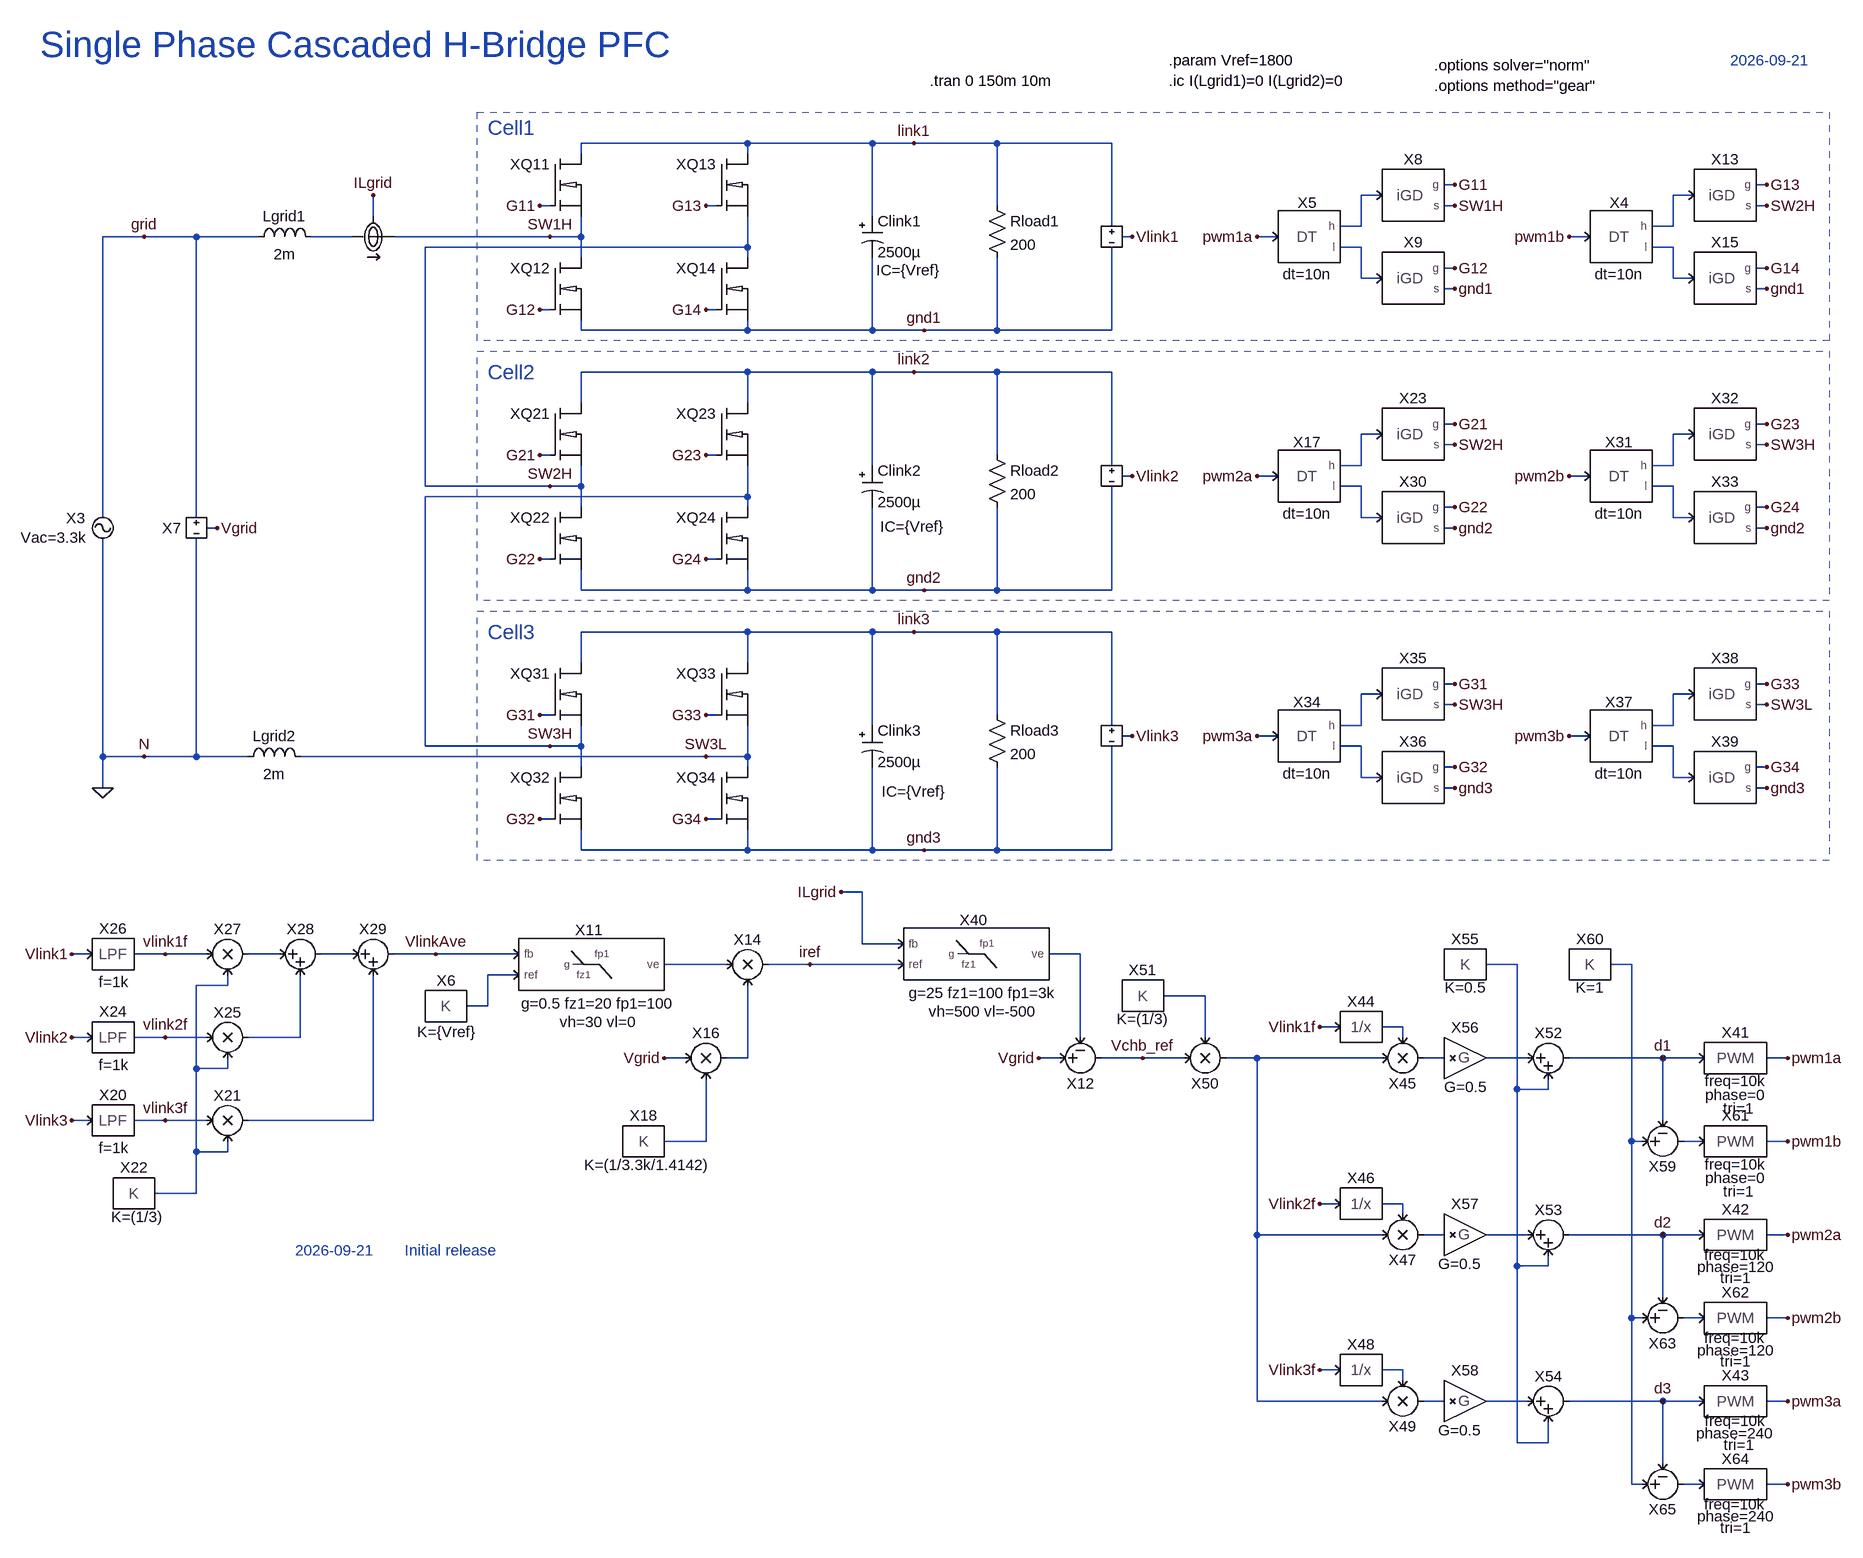
[diagram p0: schematic 1Ph-CHB-PFC_3Cell.asc]
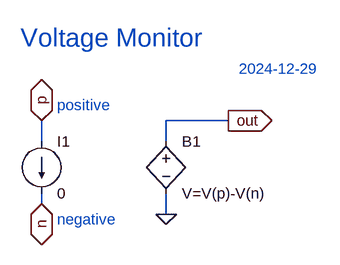
[diagram p1: sub-circuit vmon.asc]
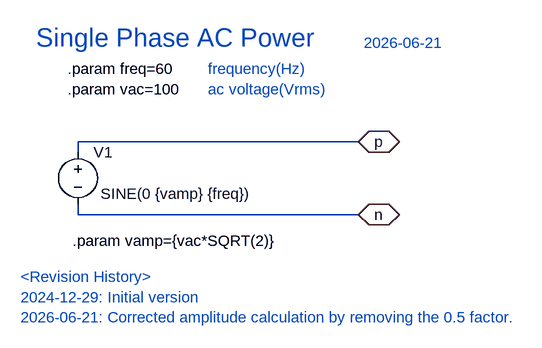
[diagram p2: sub-circuit vac1ph.asc]
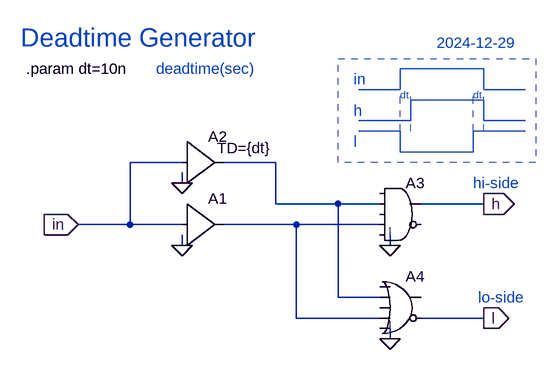
[diagram p3: sub-circuit deadtime.asc]
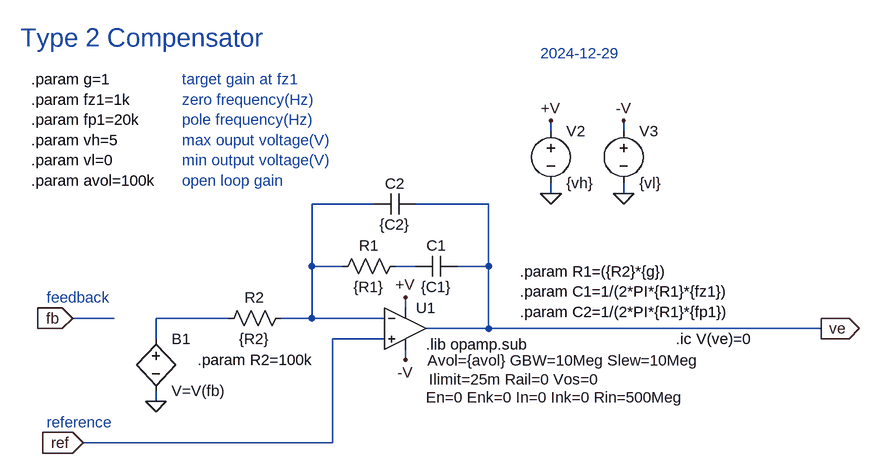
[diagram p4: sub-circuit type2.asc]
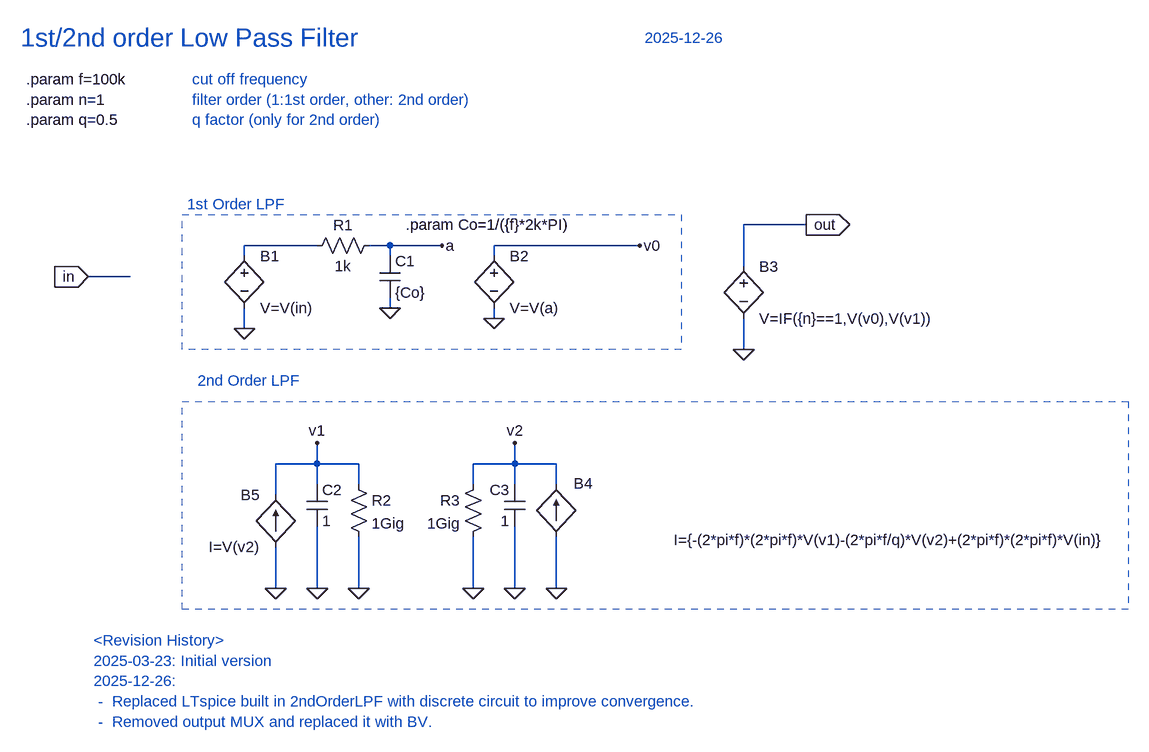
[diagram p5: sub-circuit lpf.asc]
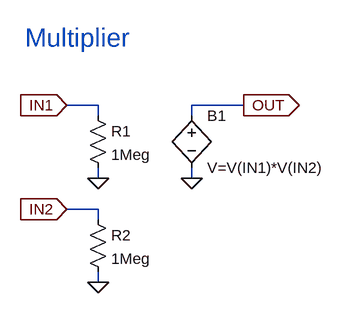
[diagram p6: sub-circuit mul.asc]
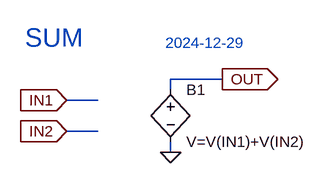
[diagram p7: sub-circuit sum.asc]
1Ph-CHB-PFC_3Cell.asc, the LTspice schematic file:
Version 4.1
SHEET 1 4184 2256
WIRE 272 -224 16 -224
WIRE 464 -224 272 -224
WIRE 528 -224 464 -224
WIRE 656 -224 528 -224
WIRE 832 -224 656 -224
WIRE 16 -208 16 -224
WIRE 272 -208 272 -224
WIRE 1360 -160 1344 -160
WIRE 1840 -160 1824 -160
WIRE 1248 -144 1216 -144
WIRE 1728 -144 1696 -144
WIRE -32 -128 -48 -128
WIRE 224 -128 208 -128
WIRE 656 -128 656 -224
WIRE 1360 -128 1344 -128
WIRE 1840 -128 1824 -128
WIRE -304 -112 -304 -144
WIRE 464 -112 464 -224
WIRE 832 -96 832 -224
WIRE 1216 -96 1216 -144
WIRE 1216 -96 1184 -96
WIRE 1696 -96 1696 -144
WIRE 1696 -96 1664 -96
WIRE -656 -80 -720 -80
WIRE -576 -80 -656 -80
WIRE -480 -80 -576 -80
WIRE -336 -80 -400 -80
WIRE -32 -80 -272 -80
WIRE 16 -80 16 -112
WIRE 16 -80 -32 -80
WIRE 864 -80 848 -80
WIRE 1088 -80 1056 -80
WIRE 1568 -80 1536 -80
WIRE 272 -64 272 -112
WIRE 272 -64 -224 -64
WIRE 1216 -64 1184 -64
WIRE 1696 -64 1664 -64
WIRE 16 -48 16 -80
WIRE 272 -48 272 -64
WIRE 1360 -32 1344 -32
WIRE 1840 -32 1824 -32
WIRE 1216 -16 1216 -64
WIRE 1248 -16 1216 -16
WIRE 1696 -16 1696 -64
WIRE 1728 -16 1696 -16
WIRE 1360 0 1344 0
WIRE 1840 0 1824 0
WIRE -32 32 -48 32
WIRE 224 32 208 32
WIRE 16 64 16 48
WIRE 272 64 272 48
WIRE 272 64 16 64
WIRE 464 64 464 -48
WIRE 464 64 272 64
WIRE 544 64 464 64
WIRE 656 64 656 -48
WIRE 656 64 544 64
WIRE 832 64 832 -64
WIRE 832 64 656 64
WIRE 272 128 16 128
WIRE 464 128 272 128
WIRE 528 128 464 128
WIRE 656 128 528 128
WIRE 832 128 656 128
WIRE 16 176 16 128
WIRE 272 176 272 128
WIRE 1360 208 1344 208
WIRE 1840 208 1824 208
WIRE 1248 224 1216 224
WIRE 1728 224 1696 224
WIRE 1360 240 1344 240
WIRE 1840 240 1824 240
WIRE -32 256 -48 256
WIRE 224 256 208 256
WIRE 656 256 656 128
WIRE 464 272 464 128
WIRE 832 272 832 128
WIRE 1216 272 1216 224
WIRE 1216 272 1184 272
WIRE 1696 272 1696 224
WIRE 1696 272 1664 272
WIRE 864 288 848 288
WIRE 1088 288 1056 288
WIRE 1568 288 1536 288
WIRE -224 304 -224 -64
WIRE -32 304 -224 304
WIRE 16 304 16 272
WIRE 16 304 -32 304
WIRE 1216 304 1184 304
WIRE 1696 304 1664 304
WIRE 272 320 272 272
WIRE 272 320 -224 320
WIRE 16 336 16 304
WIRE 272 336 272 320
WIRE 1360 336 1344 336
WIRE 1840 336 1824 336
WIRE -720 352 -720 -80
WIRE -576 352 -576 -80
WIRE 1216 352 1216 304
WIRE 1248 352 1216 352
WIRE 1696 352 1696 304
WIRE 1728 352 1696 352
WIRE -544 368 -560 368
WIRE 1360 368 1344 368
WIRE 1840 368 1824 368
WIRE -32 416 -48 416
WIRE 224 416 208 416
WIRE 16 464 16 432
WIRE 272 464 272 432
WIRE 272 464 16 464
WIRE 464 464 464 336
WIRE 464 464 272 464
WIRE 544 464 464 464
WIRE 656 464 656 336
WIRE 656 464 544 464
WIRE 832 464 832 304
WIRE 832 464 656 464
WIRE 272 528 16 528
WIRE 464 528 272 528
WIRE 528 528 464 528
WIRE 656 528 528 528
WIRE 832 528 656 528
WIRE 16 576 16 528
WIRE 272 576 272 528
WIRE 1360 608 1344 608
WIRE 1840 608 1824 608
WIRE 1248 624 1216 624
WIRE 1728 624 1696 624
WIRE 1360 640 1344 640
WIRE 1840 640 1824 640
WIRE -32 656 -48 656
WIRE 224 656 208 656
WIRE 656 656 656 528
WIRE 464 672 464 528
WIRE 832 672 832 528
WIRE 1216 672 1216 624
WIRE 1216 672 1184 672
WIRE 1696 672 1696 624
WIRE 1696 672 1664 672
WIRE 864 688 848 688
WIRE 1088 688 1056 688
WIRE 1568 688 1536 688
WIRE -224 704 -224 320
WIRE -32 704 -224 704
WIRE 16 704 16 672
WIRE 16 704 -32 704
WIRE 1216 704 1184 704
WIRE 1696 704 1664 704
WIRE -720 720 -720 384
WIRE -656 720 -720 720
WIRE -576 720 -576 384
WIRE -576 720 -656 720
WIRE -496 720 -576 720
WIRE 208 720 -416 720
WIRE 272 720 272 672
WIRE 272 720 208 720
WIRE 16 736 16 704
WIRE 272 736 272 720
WIRE 1360 736 1344 736
WIRE 1840 736 1824 736
WIRE 1216 752 1216 704
WIRE 1248 752 1216 752
WIRE 1696 752 1696 704
WIRE 1728 752 1696 752
WIRE -720 768 -720 720
WIRE 1360 768 1344 768
WIRE 1840 768 1824 768
WIRE -32 816 -48 816
WIRE 224 816 208 816
WIRE 16 864 16 832
WIRE 272 864 272 832
WIRE 272 864 16 864
WIRE 464 864 464 736
WIRE 464 864 272 864
WIRE 544 864 464 864
WIRE 656 864 656 736
WIRE 656 864 544 864
WIRE 832 864 832 704
WIRE 832 864 656 864
WIRE 448 928 416 928
WIRE 448 1008 448 928
WIRE 512 1008 448 1008
WIRE -736 1024 -768 1024
WIRE -624 1024 -672 1024
WIRE -560 1024 -624 1024
WIRE -448 1024 -496 1024
WIRE -336 1024 -384 1024
WIRE -208 1024 -272 1024
WIRE -80 1024 -208 1024
WIRE 784 1024 736 1024
WIRE 240 1040 144 1040
WIRE 368 1040 304 1040
WIRE 512 1040 368 1040
WIRE 1456 1040 1408 1040
WIRE 1632 1040 1600 1040
WIRE -80 1056 -128 1056
WIRE -528 1072 -528 1056
WIRE -528 1072 -576 1072
WIRE 976 1088 912 1088
WIRE -128 1104 -128 1056
WIRE -128 1104 -160 1104
WIRE 1184 1136 1152 1136
WIRE 1280 1136 1248 1136
WIRE -736 1152 -768 1152
WIRE -624 1152 -672 1152
WIRE -560 1152 -624 1152
WIRE -416 1152 -416 1056
WIRE -416 1152 -496 1152
WIRE 784 1152 784 1024
WIRE 976 1152 976 1088
WIRE 1280 1152 1280 1136
WIRE 176 1184 144 1184
WIRE 272 1184 272 1072
WIRE 272 1184 240 1184
WIRE 752 1184 720 1184
WIRE 880 1184 816 1184
WIRE 944 1184 880 1184
WIRE 1056 1184 1008 1184
WIRE 1248 1184 1056 1184
WIRE 1344 1184 1312 1184
WIRE 1472 1184 1408 1184
WIRE 1680 1184 1536 1184
WIRE 1744 1184 1680 1184
WIRE 1872 1184 1840 1184
WIRE -576 1200 -576 1072
WIRE -528 1200 -528 1184
WIRE -528 1200 -576 1200
WIRE 1456 1232 1456 1040
WIRE 1504 1232 1504 1216
WIRE 1504 1232 1456 1232
WIRE -736 1280 -768 1280
WIRE -624 1280 -672 1280
WIRE -560 1280 -624 1280
WIRE -304 1280 -304 1056
WIRE -304 1280 -496 1280
WIRE 1680 1280 1680 1184
WIRE 208 1312 208 1216
WIRE 208 1312 144 1312
WIRE 1632 1312 1632 1040
WIRE 1648 1312 1632 1312
WIRE 1744 1312 1712 1312
WIRE 1872 1312 1840 1312
WIRE -576 1328 -576 1200
WIRE -528 1328 -528 1312
WIRE -528 1328 -576 1328
WIRE -576 1392 -576 1328
WIRE -576 1392 -640 1392
WIRE 1184 1408 1152 1408
WIRE 1280 1408 1248 1408
WIRE 1280 1424 1280 1408
WIRE 1056 1456 1056 1184
WIRE 1248 1456 1056 1456
WIRE 1344 1456 1312 1456
WIRE 1472 1456 1408 1456
WIRE 1680 1456 1536 1456
WIRE 1744 1456 1680 1456
WIRE 1872 1456 1840 1456
WIRE 1456 1504 1456 1232
WIRE 1504 1504 1504 1488
WIRE 1504 1504 1456 1504
WIRE 1680 1552 1680 1456
WIRE 1632 1584 1632 1312
WIRE 1648 1584 1632 1584
WIRE 1744 1584 1712 1584
WIRE 1872 1584 1840 1584
WIRE 1184 1664 1152 1664
WIRE 1280 1664 1248 1664
WIRE 1280 1680 1280 1664
WIRE 1056 1712 1056 1456
WIRE 1248 1712 1056 1712
WIRE 1344 1712 1312 1712
WIRE 1472 1712 1408 1712
WIRE 1680 1712 1536 1712
WIRE 1744 1712 1680 1712
WIRE 1872 1712 1840 1712
WIRE 1456 1776 1456 1504
WIRE 1504 1776 1504 1744
WIRE 1504 1776 1456 1776
WIRE 1680 1808 1680 1712
WIRE 1632 1840 1632 1584
WIRE 1648 1840 1632 1840
WIRE 1744 1840 1712 1840
WIRE 1872 1840 1840 1840
FLAG -48 -128 G11
FLAG -48 32 G12
FLAG -32 -80 SW1H
FLAG 528 -224 link1
FLAG -656 -80 grid
FLAG -304 -144 ILgrid
FLAG 864 -80 Vlink1
FLAG -544 368 Vgrid
FLAG 1360 -160 G11
FLAG 1360 -128 SW1H
FLAG 1360 -32 G12
FLAG 1360 0 gnd1
FLAG 208 -128 G13
FLAG 208 32 G14
FLAG -48 256 G21
FLAG -48 416 G22
FLAG 528 128 link2
FLAG 864 288 Vlink2
FLAG 208 256 G23
FLAG 208 416 G24
FLAG -48 656 G31
FLAG -48 816 G32
FLAG 528 528 link3
FLAG 864 688 Vlink3
FLAG 208 656 G33
FLAG 208 816 G34
FLAG -768 1280 Vlink3
FLAG -768 1152 Vlink2
FLAG -768 1024 Vlink1
FLAG -208 1024 VlinkAve
FLAG 544 64 gnd1
FLAG 544 464 gnd2
FLAG 544 864 gnd3
FLAG 1840 -160 G13
FLAG 1840 -128 SW2H
FLAG 1840 -32 G14
FLAG 1840 0 gnd1
FLAG 1360 208 G21
FLAG 1360 240 SW2H
FLAG 1360 336 G22
FLAG 1360 368 gnd2
FLAG 1840 208 G23
FLAG 1840 240 SW3H
FLAG 1840 336 G24
FLAG 1840 368 gnd2
FLAG -32 304 SW2H
FLAG -32 704 SW3H
FLAG -656 720 N
FLAG 1360 608 G31
FLAG 1360 640 SW3H
FLAG 1360 736 G32
FLAG 1360 768 gnd3
FLAG 1840 608 G33
FLAG 1840 640 SW3L
FLAG 1840 736 G34
FLAG 1840 768 gnd3
FLAG 208 720 SW3L
FLAG 416 928 ILgrid
FLAG 144 1184 Vgrid
FLAG 368 1040 iref
FLAG 720 1184 Vgrid
FLAG 880 1184 Vchb_ref
FLAG 1056 -80 pwm1a
FLAG 1536 -80 pwm1b
FLAG 1056 288 pwm2a
FLAG 1536 288 pwm2b
FLAG 1056 688 pwm3a
FLAG 1536 688 pwm3b
FLAG 1872 1184 pwm1a
FLAG 1872 1312 pwm1b
FLAG 1872 1456 pwm2a
FLAG 1872 1584 pwm2b
FLAG 1872 1712 pwm3a
FLAG 1872 1840 pwm3b
FLAG 1152 1136 Vlink1f
FLAG 1152 1408 Vlink2f
FLAG 1152 1664 Vlink3f
FLAG 1680 1184 d1
FLAG 1680 1456 d2
FLAG 1680 1712 d3
FLAG -720 768 0
FLAG -624 1024 vlink1f
FLAG -624 1152 vlink2f
FLAG -624 1280 vlink3f
SYMBOL ind -496 -64 R270
WINDOW 0 32 56 VTop 2
WINDOW 3 5 56 VBottom 2
SYMATTR InstName Lgrid1
SYMATTR Value 2m
SYMATTR SpiceLine Rser=1m
SYMBOL polcap 448 -112 R0
WINDOW 3 24 56 Left 2
WINDOW 123 22 83 Left 2
SYMATTR Value 2500µ
SYMATTR Value2 IC={Vref}
SYMATTR InstName Clink1
SYMATTR Description Capacitor
SYMATTR Type cap
SYMATTR SpiceLine Rser=10m
SYMBOL res 640 -144 R0
SYMATTR InstName Rload1
SYMATTR Value 200
SYMBOL IMON -304 -80 M180
WINDOW 0 0 -26 Invisible 2
SYMATTR InstName X1
SYMBOL VMON 832 -80 R0
WINDOW 0 57 -5 Invisible 2
SYMATTR InstName X2
SYMBOL VAC1ph -720 368 R0
WINDOW 39 -25 15 Right 2
WINDOW 0 -27 -15 Right 2
SYMATTR SpiceLine Vac=3.3k
SYMATTR InstName X3
SYMBOL DEADTIME 1136 -80 R0
WINDOW 0 -3 -68 Top 2
WINDOW 39 -3 42 Top 2
SYMATTR InstName X5
SYMBOL CONST -192 1104 R0
WINDOW 39 1 55 Bottom 2
SYMATTR SpiceLine K={Vref}
SYMATTR InstName X6
SYMBOL VMON -576 368 R0
WINDOW 0 -23 0 Right 2
SYMATTR InstName X7
SYMBOL iGD 1296 -144 R0
SYMATTR InstName X8
SYMBOL iGD 1296 -16 R0
SYMATTR InstName X9
SYMBOL TYPE2 32 1040 R0
WINDOW 0 -4 -53 Center 2
WINDOW 39 10 60 Center 2
WINDOW 40 10 88 Center 2
SYMATTR InstName X11
SYMATTR SpiceLine g=0.5 fz1=20 fp1=100
SYMATTR SpiceLine2 vh=30 vl=0
SYMBOL iNMOS 16 -160 R0
SYMATTR InstName XQ11
SYMBOL iNMOS 16 0 R0
SYMATTR InstName XQ12
SYMBOL iNMOS 272 -160 R0
SYMATTR InstName XQ13
SYMBOL iNMOS 272 0 R0
SYMATTR InstName XQ14
SYMBOL polcap 448 272 R0
WINDOW 3 24 56 Left 2
WINDOW 123 28 94 Left 2
SYMATTR Value 2500µ
SYMATTR Value2 IC={Vref}
SYMATTR InstName Clink2
SYMATTR Description Capacitor
SYMATTR Type cap
SYMATTR SpiceLine Rser=10m
SYMBOL res 640 240 R0
SYMATTR InstName Rload2
SYMATTR Value 200
SYMBOL VMON 832 288 R0
WINDOW 0 57 -5 Invisible 2
SYMATTR InstName X10
SYMBOL iNMOS 16 224 R0
SYMATTR InstName XQ21
SYMBOL iNMOS 16 384 R0
SYMATTR InstName XQ22
SYMBOL iNMOS 272 224 R0
SYMATTR InstName XQ23
SYMBOL iNMOS 272 384 R0
SYMATTR InstName XQ24
SYMBOL polcap 448 672 R0
WINDOW 3 24 56 Left 2
WINDOW 123 30 102 Left 2
SYMATTR Value 2500µ
SYMATTR Value2 IC={Vref}
SYMATTR InstName Clink3
SYMATTR Description Capacitor
SYMATTR Type cap
SYMATTR SpiceLine Rser=10m
SYMBOL res 640 640 R0
SYMATTR InstName Rload3
SYMATTR Value 200
SYMBOL VMON 832 688 R0
WINDOW 0 57 -5 Invisible 2
SYMATTR InstName X19
SYMBOL iNMOS 16 624 R0
SYMATTR InstName XQ31
SYMBOL iNMOS 16 784 R0
SYMATTR InstName XQ32
SYMBOL iNMOS 272 624 R0
SYMATTR InstName XQ33
SYMBOL iNMOS 272 784 R0
SYMATTR InstName XQ34
SYMBOL PowerSim\\LPF -704 1280 R0
WINDOW 3 1 58 Bottom 2
SYMATTR Value f=1k
SYMATTR InstName X20
SYMBOL MUL -528 1280 R0
SYMATTR InstName X21
SYMBOL PowerSim\\CONST -672 1392 R0
WINDOW 39 5 52 Bottom 2
SYMATTR SpiceLine K=(1/3)
SYMATTR InstName X22
SYMBOL PowerSim\\LPF -704 1152 R0
WINDOW 3 1 58 Bottom 2
SYMATTR Value f=1k
SYMATTR InstName X24
SYMBOL MUL -528 1152 R0
SYMATTR InstName X25
SYMBOL PowerSim\\LPF -704 1024 R0
WINDOW 3 1 58 Bottom 2
SYMATTR Value f=1k
SYMATTR InstName X26
SYMBOL MUL -528 1024 R0
SYMATTR InstName X27
SYMBOL PowerSim\\SUM -416 1024 R0
SYMATTR InstName X28
SYMBOL PowerSim\\SUM -304 1024 R0
SYMATTR InstName X29
SYMBOL DEADTIME 1616 -80 R0
WINDOW 0 -3 -68 Top 2
WINDOW 39 -3 42 Top 2
SYMATTR InstName X4
SYMBOL iGD 1776 -144 R0
SYMATTR InstName X13
SYMBOL iGD 1776 -16 R0
SYMATTR InstName X15
SYMBOL DEADTIME 1136 288 R0
WINDOW 0 -3 -68 Top 2
WINDOW 39 -3 42 Top 2
SYMATTR InstName X17
SYMBOL iGD 1296 224 R0
SYMATTR InstName X23
SYMBOL iGD 1296 352 R0
SYMATTR InstName X30
SYMBOL DEADTIME 1616 288 R0
WINDOW 0 -3 -68 Top 2
WINDOW 39 -3 42 Top 2
SYMATTR InstName X31
SYMBOL iGD 1776 224 R0
SYMATTR InstName X32
SYMBOL iGD 1776 352 R0
SYMATTR InstName X33
SYMBOL DEADTIME 1136 688 R0
WINDOW 0 -3 -68 Top 2
WINDOW 39 -3 42 Top 2
SYMATTR InstName X34
SYMBOL iGD 1296 624 R0
SYMATTR InstName X35
SYMBOL iGD 1296 752 R0
SYMATTR InstName X36
SYMBOL DEADTIME 1616 688 R0
WINDOW 0 -3 -68 Top 2
WINDOW 39 -3 42 Top 2
SYMATTR InstName X37
SYMBOL iGD 1776 624 R0
SYMATTR InstName X38
SYMBOL iGD 1776 752 R0
SYMATTR InstName X39
SYMBOL ind -512 736 R270
WINDOW 0 32 56 VTop 2
WINDOW 3 5 56 VBottom 2
SYMATTR InstName Lgrid2
SYMATTR Value 2m
SYMATTR SpiceLine Rser=1m
SYMBOL MUL 272 1040 R0
SYMATTR InstName X14
SYMBOL MUL 208 1184 R0
SYMATTR InstName X16
SYMBOL PowerSim\\CONST 112 1312 R0
WINDOW 39 5 52 Bottom 2
SYMATTR SpiceLine K=(1/3.3k/1.4142)
SYMATTR InstName X18
SYMBOL TYPE2 624 1024 R0
WINDOW 0 -4 -53 Center 2
WINDOW 39 10 60 Center 2
WINDOW 40 10 88 Center 2
SYMATTR InstName X40
SYMATTR SpiceLine g=25 fz1=100 fp1=3k
SYMATTR SpiceLine2 vh=500 vl=-500
SYMBOL PowerSim\\SUB 784 1184 M180
SYMATTR InstName X12
SYMBOL PowerSim\\PWM 1792 1184 R0
WINDOW 39 0 51 Bottom 2
WINDOW 40 0 72 Bottom 2
WINDOW 3 5 93 Bottom 2
SYMATTR SpiceLine freq=10k
SYMATTR Value tri=1
SYMATTR InstName X41
SYMATTR Value2 ""
SYMBOL PowerSim\\PWM 1792 1456 R0
WINDOW 39 -1 46 Bottom 2
WINDOW 40 1 65 Bottom 2
WINDOW 3 0 82 Bottom 2
SYMATTR SpiceLine freq=10k
SYMATTR SpiceLine2 phase=120
SYMATTR Value tri=1
SYMATTR InstName X42
SYMATTR Value2 ""
SYMBOL PowerSim\\PWM 1792 1712 R0
WINDOW 39 0 46 Bottom 2
WINDOW 40 0 65 Bottom 2
WINDOW 3 6 83 Bottom 2
SYMATTR SpiceLine freq=10k
SYMATTR SpiceLine2 phase=240
SYMATTR Value tri=1
SYMATTR InstName X43
SYMATTR Value2 ""
SYMBOL PowerSim\\INVERSE 1216 1136 R0
SYMATTR InstName X44
SYMBOL PowerSim\\MUL 1280 1184 M180
SYMATTR InstName X45
SYMBOL PowerSim\\INVERSE 1216 1408 R0
SYMATTR InstName X46
SYMBOL PowerSim\\MUL 1280 1456 M180
SYMATTR InstName X47
SYMBOL PowerSim\\INVERSE 1216 1664 R0
SYMATTR InstName X48
SYMBOL PowerSim\\MUL 1280 1712 M180
SYMATTR InstName X49
SYMBOL PowerSim\\MUL 976 1184 M180
SYMATTR InstName X50
SYMBOL PowerSim\\CONST 880 1088 R0
WINDOW 39 0 51 Bottom 2
SYMATTR SpiceLine K=(1/3)
SYMATTR InstName X51
SYMBOL PowerSim\\SUM 1504 1184 R0
SYMATTR InstName X52
SYMBOL PowerSim\\SUM 1504 1456 R0
SYMATTR InstName X53
SYMBOL PowerSim\\SUM 1504 1712 R0
SYMATTR InstName X54
SYMBOL PowerSim\\CONST 1376 1040 R0
WINDOW 39 0 51 Bottom 2
SYMATTR SpiceLine K=0.5
SYMATTR InstName X55
SYMBOL PowerSim\\GAIN 1376 1184 R0
WINDOW 39 1 60 Bottom 2
SYMATTR SpiceLine G=0.5
SYMATTR InstName X56
SYMBOL PowerSim\\GAIN 1376 1456 R0
WINDOW 39 -8 60 Bottom 2
SYMATTR SpiceLine G=0.5
SYMATTR InstName X57
SYMBOL PowerSim\\GAIN 1376 1712 R0
WINDOW 39 -8 60 Bottom 2
SYMATTR SpiceLine G=0.5
SYMATTR InstName X58
SYMBOL PowerSim\\SUB 1680 1312 M180
SYMATTR InstName X59
SYMBOL PowerSim\\CONST 1568 1040 R0
WINDOW 39 0 51 Bottom 2
SYMATTR InstName X60
SYMBOL PowerSim\\PWM 1792 1312 R0
WINDOW 39 0 51 Bottom 2
WINDOW 40 0 72 Bottom 2
WINDOW 3 5 93 Bottom 2
SYMATTR SpiceLine freq=10k
SYMATTR Value tri=1
SYMATTR InstName X61
SYMATTR Value2 ""
SYMBOL PowerSim\\PWM 1792 1584 R0
WINDOW 39 -1 46 Bottom 2
WINDOW 40 1 65 Bottom 2
WINDOW 3 0 82 Bottom 2
SYMATTR SpiceLine freq=10k
SYMATTR SpiceLine2 phase=120
SYMATTR Value tri=1
SYMATTR InstName X62
SYMATTR Value2 ""
SYMBOL PowerSim\\SUB 1680 1584 M180
SYMATTR InstName X63
SYMBOL PowerSim\\PWM 1792 1840 R0
WINDOW 39 -1 46 Bottom 2
WINDOW 40 1 65 Bottom 2
WINDOW 3 0 82 Bottom 2
SYMATTR SpiceLine freq=10k
SYMATTR SpiceLine2 phase=240
SYMATTR Value tri=1
SYMATTR InstName X64
SYMATTR Value2 ""
SYMBOL PowerSim\\SUB 1680 1840 M180
SYMATTR InstName X65
TEXT -816 -376 Left 5 ;Single Phase Cascaded H-Bridge PFC
TEXT 552 -320 Left 2 !.tran 0 150m 10m
TEXT 1784 -352 Left 2 ;2026-09-21
TEXT -424 1480 Left 2 ;2026-09-21       Initial release
TEXT 1328 -344 Left 2 !.options solver="norm"\n.options method="gear"
TEXT 920 -352 Left 2 !.param Vref=1800
TEXT 920 -320 Left 2 !.ic I(Lgrid1)=0 I(Lgrid2)=0
TEXT -128 -248 Left 3 ;Cell1
TEXT -128 128 Left 3 ;Cell2
TEXT -128 528 Left 3 ;Cell3
RECTANGLE Normal 1936 80 -144 -272 2
RECTANGLE Normal 1936 480 -144 96 2
RECTANGLE Normal 1936 880 -144 496 2

vmon.asc, the sub-circuit schematic file:
Version 4
SHEET 1 880 680
WIRE 176 -32 80 -32
WIRE -112 0 -112 -32
WIRE 80 0 80 -32
WIRE -112 96 -112 80
WIRE 80 112 80 80
FLAG -112 -32 p
IOPIN -112 -32 BiDir
FLAG -112 96 n
IOPIN -112 96 BiDir
FLAG 176 -32 out
IOPIN 176 -32 Out
FLAG 80 112 0
SYMBOL bv 80 -16 R0
SYMATTR InstName B1
SYMATTR Value V=V(p)-V(n)
SYMBOL current -112 0 R0
WINDOW 123 0 0 Left 0
WINDOW 39 0 0 Left 0
SYMATTR InstName I1
SYMATTR Value 0
TEXT -144 -160 Left 4 ;Voltage Monitor
TEXT -88 -56 Left 2 ;positive
TEXT -88 120 Left 2 ;negative
TEXT 192 -112 Left 2 ;2024-12-29

vac1ph.asc, the sub-circuit schematic file:
Version 4.1
SHEET 1 1308 680
WIRE 496 112 64 112
WIRE 64 128 64 112
WIRE 64 224 64 208
WIRE 496 224 64 224
FLAG 496 112 p
IOPIN 496 112 BiDir
FLAG 496 224 n
IOPIN 496 224 BiDir
SYMBOL voltage 64 112 R0
WINDOW 3 35 80 Left 2
WINDOW 123 0 0 Left 0
WINDOW 39 0 0 Left 0
SYMATTR Value SINE(0 {vamp} {freq})
SYMATTR InstName V1
TEXT 48 0 Left 2 !.param freq=60\n.param vac=100
TEXT 0 -48 Left 4 ;Single Phase AC Power
TEXT 264 0 Left 2 ;frequency(Hz)\nac voltage(Vrms)
TEXT 56 264 Left 2 !.param vamp={vac*SQRT(2)}
TEXT 504 -40 Left 2 ;2026-06-21
TEXT -24 320 Left 2 ;<Revision History>\n2024-12-29: Initial version\n2026-06-21: Corrected amplitude calculation by removing the 0.5 factor.

deadtime.asc, the sub-circuit schematic file:
Version 4
SHEET 1 1412 1312
WIRE 64 288 -16 288
WIRE 208 288 128 288
WIRE 64 320 64 304
WIRE 208 352 208 288
WIRE 304 352 208 352
WIRE 368 352 304 352
WIRE 528 352 432 352
WIRE -16 384 -16 288
WIRE -16 384 -96 384
WIRE 64 384 -16 384
WIRE 240 384 128 384
WIRE 368 384 240 384
WIRE 64 416 64 400
WIRE 384 416 384 400
WIRE 304 496 304 352
WIRE 368 496 304 496
WIRE 240 528 240 384
WIRE 368 528 240 528
WIRE 528 528 432 528
WIRE 384 560 384 544
FLAG -96 384 in
IOPIN -96 384 In
FLAG 64 416 0
FLAG 64 320 0
FLAG 384 416 0
FLAG 384 560 0
FLAG 528 352 h
IOPIN 528 352 Out
FLAG 528 528 l
IOPIN 528 528 Out
SYMBOL Digital\\buf1 64 320 R0
SYMATTR InstName A1
SYMBOL Digital\\buf1 64 224 R0
WINDOW 3 54 42 Left 2
SYMATTR Value TD={dt}
SYMATTR InstName A2
SYMBOL Digital\\and 400 304 R0
SYMATTR InstName A3
SYMBOL Digital\\or 400 448 R0
SYMATTR InstName A4
TEXT -176 144 Left 2 !.param dt=10n
TEXT -184 96 Left 4 ;Deadtime Generator
TEXT 24 144 Left 2 ;deadtime(sec)
TEXT 512 320 Left 2 ;hi-side
TEXT 520 496 Left 2 ;lo-side
TEXT 328 160 Left 2 ;in
TEXT 328 208 Left 2 ;h
TEXT 328 256 Left 2 ;l
TEXT 400 184 Left 1 ;dt
TEXT 512 184 Left 1 ;dt
TEXT 456 104 Left 2 ;2024-12-29
LINE Normal 400 176 336 176
LINE Normal 400 176 400 144
LINE Normal 528 144 400 144
LINE Normal 528 176 528 144
LINE Normal 592 176 528 176
LINE Normal 416 224 336 224
LINE Normal 416 224 416 192
LINE Normal 528 192 416 192
LINE Normal 528 224 528 192
LINE Normal 592 224 528 224
LINE Normal 400 240 336 240
LINE Normal 400 272 400 240
LINE Normal 512 272 400 272
LINE Normal 512 272 512 240
LINE Normal 592 240 512 240
LINE Normal 400 240 400 176 2
LINE Normal 512 240 512 176 2
LINE Normal 416 240 416 176 2
LINE Normal 528 240 528 176 2
RECTANGLE Normal 608 288 304 128 2

type2.asc, the sub-circuit schematic file:
Version 4
SHEET 1 1008 680
WIRE 464 -144 464 -160
WIRE 576 -144 576 -160
WIRE 464 -48 464 -64
WIRE 576 -48 576 -64
WIRE 192 -32 96 -32
WIRE 368 -32 256 -32
WIRE 96 64 96 -32
WIRE 144 64 96 64
WIRE 256 64 224 64
WIRE 368 64 368 -32
WIRE 368 64 320 64
WIRE 240 128 240 112
WIRE -208 144 -272 144
WIRE -32 144 -144 144
WIRE 96 144 96 64
WIRE 96 144 48 144
WIRE 208 144 96 144
WIRE 368 160 368 64
WIRE 368 160 272 160
WIRE 880 160 368 160
WIRE -144 176 -144 144
WIRE 208 176 128 176
WIRE 240 208 240 192
WIRE -144 272 -144 256
WIRE 128 336 128 176
WIRE 128 336 -256 336
FLAG -272 144 fb
IOPIN -272 144 In
FLAG -256 336 ref
IOPIN -256 336 In
FLAG -144 272 0
FLAG 880 160 ve
IOPIN 880 160 Out
FLAG 576 -48 0
FLAG 464 -48 0
FLAG 464 -160 +V
FLAG 576 -160 -V
FLAG 240 112 +V
FLAG 240 208 -V
SYMBOL res 240 48 R90
WINDOW 0 0 56 VBottom 2
WINDOW 3 32 56 VTop 2
SYMATTR InstName R1
SYMATTR Value {R1}
SYMBOL cap 320 48 R90
WINDOW 0 0 32 VBottom 2
WINDOW 3 32 32 VTop 2
SYMATTR InstName C1
SYMATTR Value {C1}
SYMBOL cap 256 -48 R90
WINDOW 0 0 32 VBottom 2
WINDOW 3 32 32 VTop 2
SYMATTR InstName C2
SYMATTR Value {C2}
SYMBOL bv -144 160 R0
SYMATTR InstName B1
SYMATTR Value V=V(fb)
SYMBOL res 64 128 R90
WINDOW 0 0 56 VBottom 2
WINDOW 3 32 56 VTop 2
SYMATTR InstName R2
SYMATTR Value {R2}
SYMBOL UniversalOpAmp2 240 160 R0
WINDOW 123 34 49 Left 2
WINDOW 39 36 78 Left 2
WINDOW 40 32 106 Left 2
SYMATTR Value2 Avol={avol} GBW=10Meg Slew=10Meg
SYMATTR InstName U1
SYMBOL voltage 464 -160 R0
SYMATTR InstName V2
SYMATTR Value {vh}
SYMBOL voltage 576 -160 R0
SYMATTR InstName V3
SYMATTR Value {vl}
TEXT 272 184 Left 2 !.lib opamp.sub
TEXT -336 -224 Left 2 !.param g=1\n.param fz1=1k\n.param fp1=20k\n.param vh=5\n.param vl=0\n.param avol=100k
TEXT 416 72 Left 2 !.param R1=({R2}*{g})\n.param C1=1/(2*PI*{R1}*{fz1})\n.param C2=1/(2*PI*{R1}*{fp1})
TEXT -352 -288 Left 4 ;Type 2 Compensator
TEXT -80 208 Left 2 !.param R2=100k
TEXT -104 -224 Left 2 ;target gain at fz1\nzero frequency(Hz)\npole frequency(Hz)\nmax ouput voltage(V)\nmin output voltage(V)\nopen loop gain
TEXT -312 112 Left 2 ;feedback
TEXT -312 304 Left 2 ;reference
TEXT 656 176 Left 2 !.ic V(ve)=0
TEXT 448 -264 Left 2 ;2024-12-29

lpf.asc, the sub-circuit schematic file:
Version 4.1
SHEET 1 1652 804
WIRE 944 -80 848 -80
WIRE 192 -48 80 -48
WIRE 304 -48 272 -48
WIRE 384 -48 304 -48
WIRE 688 -48 464 -48
WIRE 80 -32 80 -48
WIRE 304 -32 304 -48
WIRE 464 -32 464 -48
WIRE 848 -16 848 -80
WIRE -96 0 -160 0
WIRE 304 48 304 32
WIRE 464 64 464 48
WIRE 80 80 80 48
WIRE 848 112 848 64
WIRE 192 288 192 256
WIRE 192 288 128 288
WIRE 256 288 192 288
WIRE 496 288 496 256
WIRE 496 288 432 288
WIRE 560 288 496 288
WIRE 192 320 192 288
WIRE 256 320 256 288
WIRE 432 320 432 288
WIRE 496 320 496 288
WIRE 560 320 560 288
WIRE 128 336 128 288
WIRE 128 480 128 416
WIRE 192 480 192 384
WIRE 256 480 256 400
WIRE 432 480 432 400
WIRE 496 480 496 384
WIRE 560 480 560 400
FLAG -160 0 in
IOPIN -160 0 In
FLAG 944 -80 out
IOPIN 944 -80 Out
FLAG 304 48 0
FLAG 80 80 0
FLAG 384 -48 a
FLAG 464 64 0
FLAG 848 112 0
FLAG 256 480 0
FLAG 192 256 v1
FLAG 496 256 v2
FLAG 128 480 0
FLAG 560 480 0
FLAG 688 -48 v0
FLAG 192 480 0
FLAG 496 480 0
FLAG 432 480 0
SYMBOL res 288 -64 R90
WINDOW 0 0 56 VBottom 2
WINDOW 3 32 56 VTop 2
SYMATTR InstName R1
SYMATTR Value 1k
SYMBOL cap 288 -32 R0
SYMATTR InstName C1
SYMATTR Value {Co}
SYMBOL bv 80 -48 R0
SYMATTR InstName B1
SYMATTR Value V=V(in)
SYMBOL bv 464 -48 R0
SYMATTR InstName B2
SYMATTR Value V=V(a)
SYMBOL bv 848 -32 R0
SYMATTR InstName B3
SYMATTR Value V=IF({n}==1,V(v0),V(v1))
SYMBOL res 240 304 R0
SYMATTR InstName R2
SYMATTR Value 1Gig
SYMBOL cap 176 320 R0
SYMATTR InstName C2
SYMATTR Value 1
SYMBOL bi 128 416 R180
WINDOW 0 24 80 Left 2
WINDOW 3 24 0 Left 2
SYMATTR InstName B5
SYMATTR Value I=V(v2)
SYMBOL res 448 304 M0
SYMATTR InstName R3
SYMATTR Value 1Gig
SYMBOL cap 512 320 M0
SYMATTR InstName C3
SYMATTR Value 1
SYMBOL bi 560 400 R180
WINDOW 3 -848 -5 Left 2
WINDOW 0 -56 82 Left 2
SYMATTR Value I={-(2*pi*f)*(2*pi*f)*V(v1)-(2*pi*f/q)*V(v2)+(2*pi*f)*(2*pi*f)*V(in)}
SYMATTR InstName B4
TEXT -264 -368 Left 4 ;1st/2nd order Low Pass Filter
TEXT 696 -368 Left 2 ;2025-12-26
TEXT -256 -304 Left 2 !.param f=100k\n.param n=1\n.param q=0.5
TEXT 328 -80 Left 2 !.param Co=1/({f}*2k*PI)
TEXT 0 -304 Left 2 ;cut off frequency\nfilter order (1:1st order, other: 2nd order)\nq factor (only for 2nd order)
TEXT -8 -112 Left 2 ;1st Order LPF
TEXT 8 160 Left 2 ;2nd Order LPF
TEXT -152 560 Left 2 ;<Revision History>\n2025-03-23: Initial version\n2025-12-26: \n -  Replaced LTspice built in 2ndOrderLPF with discrete circuit to improve convergence.\n -  Removed output MUX and replaced it with BV.
RECTANGLE Normal 752 112 -16 -96 2
RECTANGLE Normal 1440 512 -16 192 2

mul.asc, the sub-circuit schematic file:
Version 4
SHEET 1 880 680
WIRE 96 48 48 48
WIRE 320 48 240 48
WIRE 96 64 96 48
WIRE 240 64 240 48
WIRE 96 160 96 144
WIRE 240 160 240 144
WIRE 96 208 48 208
WIRE 96 224 96 208
WIRE 96 320 96 304
FLAG 48 48 IN1
IOPIN 48 48 In
FLAG 48 208 IN2
IOPIN 48 208 In
FLAG 240 160 0
FLAG 320 48 OUT
IOPIN 320 48 Out
FLAG 96 160 0
FLAG 96 320 0
SYMBOL bv 240 48 R0
SYMATTR InstName B1
SYMATTR Value V=V(IN1)*V(IN2)
SYMBOL res 80 48 R0
SYMATTR InstName R1
SYMATTR Value 1Meg
SYMBOL res 80 208 R0
SYMATTR InstName R2
SYMATTR Value 1Meg
TEXT -16 -56 Left 4 ;Multiplier

sum.asc, the sub-circuit schematic file:
Version 4
SHEET 1 880 680
WIRE 288 96 208 96
WIRE 208 112 208 96
WIRE 96 128 48 128
WIRE 96 176 48 176
WIRE 208 208 208 192
FLAG 48 128 IN1
IOPIN 48 128 In
FLAG 48 176 IN2
IOPIN 48 176 In
FLAG 208 208 0
FLAG 288 96 OUT
IOPIN 288 96 Out
SYMBOL bv 208 96 R0
SYMATTR InstName B1
SYMATTR Value V=V(IN1)+V(IN2)
TEXT -16 32 Left 4 ;SUM
TEXT 200 40 Left 2 ;2024-12-29

sub.asc, the sub-circuit schematic file:
Version 4
SHEET 1 880 680
WIRE 288 96 208 96
WIRE 208 112 208 96
WIRE 96 128 48 128
WIRE 96 176 48 176
WIRE 208 208 208 192
FLAG 48 128 IN1
IOPIN 48 128 In
FLAG 48 176 IN2
IOPIN 48 176 In
FLAG 208 208 0
FLAG 288 96 OUT
IOPIN 288 96 Out
SYMBOL bv 208 96 R0
SYMATTR InstName B1
SYMATTR Value V=V(IN1)-V(IN2)
TEXT -16 40 Left 2 ;SUBTRACT
TEXT 224 48 Left 2 ;2024-12-29

pwm.asc, the sub-circuit schematic file:
Version 4.1
SHEET 1 1668 1312
WIRE 32 64 -96 64
WIRE 432 80 416 80
WIRE 480 80 432 80
WIRE 576 80 480 80
WIRE 704 80 640 80
WIRE 480 96 480 80
WIRE 576 112 576 96
WIRE 32 160 -96 160
WIRE 480 208 480 176
WIRE -96 272 -96 160
WIRE -96 384 -96 352
FLAG -96 64 duty
IOPIN -96 64 In
FLAG 704 80 pwm
IOPIN 704 80 Out
FLAG 480 208 0
FLAG 432 80 c
FLAG 576 112 0
FLAG -96 384 0
FLAG -96 160 saw
SYMBOL res 464 80 R0
SYMATTR InstName R2
SYMATTR Value 1k
SYMBOL Digital\\buf1 576 16 R0
SYMATTR InstName A1
SYMBOL voltage -96 256 R0
WINDOW 123 0 0 Left 0
WINDOW 39 0 0 Left 0
SYMATTR InstName V1
SYMATTR Value PULSE(0 1 {phase/(360*freq)} {IF(tri==0,1/freq-1n,1/(2*freq))} {IF(tri==0,0.5n,1/(2*freq))} {IF(tri==0,0.5n,0)} {1/freq})
TEXT 72 32 Left 2 !.machine\n.state LO 0\n.state HI 1\n.rule HI LO V(saw)>V(duty)\n.rule LO HI V(saw)< V(duty)\n.output (c) state\n.endmachine
TEXT -144 -120 Left 2 !.param freq=100k
TEXT 624 120 Left 2 !.ic V(pwm)=0
TEXT -144 -88 Left 2 !.param phase=0
TEXT -144 -168 Left 4 ;Pulse Width Modulator
TEXT 464 -168 Left 2 ;2026-09-21
TEXT 104 -120 Left 2 ;frequency(Hz)
TEXT -144 -56 Left 2 !.param tri=0
TEXT 104 -56 Left 2 ;0: Saw, 1; Triangular
TEXT 104 -88 Left 2 ;phase(deg)
TEXT -96 448 Left 2 ;<Revision History>\n2024-12-29: Initial version\n2026-09-21: Added tri parameter to select a triangular carrier (tri=1) or retain the original sawtooth carrier (tri=0, default).
RECTANGLE Normal 416 240 32 0 2

inverse.asc, the sub-circuit schematic file:
Version 4
SHEET 1 1360 680
WIRE 672 144 192 144
WIRE 1264 144 672 144
WIRE 672 160 672 144
WIRE 192 176 192 144
WIRE 80 208 32 208
WIRE 672 240 672 224
WIRE 192 288 192 256
FLAG 32 208 in
IOPIN 32 208 In
FLAG 192 288 0
FLAG 1264 144 out
IOPIN 1264 144 Out
FLAG 672 240 0
SYMBOL bv 192 160 R0
WINDOW 3 37 125 Left 2
SYMATTR Value V=IF(V(in)>0,IF(V(in)>(1/{vsat}),1/V(in),{vsat}),IF(V(in)>(-1/{vsat}),-{vsat},1/V(in)))
SYMATTR InstName B1
SYMBOL cap 656 160 R0
SYMATTR InstName C1
SYMATTR Value 10p
SYMATTR SpiceLine Rser=1k
TEXT -32 16 Left 4 ;Inverse
TEXT 1168 8 Left 2 ;2025-2-23
TEXT -24 64 Left 2 !.param vsat=1k
TEXT 224 64 Left 2 ;saturation voltage
TEXT 120 400 Left 2 ;<Revision History>\n2025-01-03: Initial Versoin.\n2025-02-23: Added RC snubber(10pF-1kohm) at output to reduce spike

gain.asc, the sub-circuit schematic file:
Version 4
SHEET 1 880 680
WIRE 0 64 -48 64
WIRE 240 64 144 64
WIRE 144 96 144 64
WIRE 144 192 144 176
FLAG 144 192 0
FLAG 240 64 out
IOPIN 240 64 Out
FLAG -48 64 in
IOPIN -48 64 In
SYMBOL bv 144 80 R0
WINDOW 3 23 92 Left 2
SYMATTR Value V={G}*V(in)
SYMATTR InstName B1
TEXT -88 8 Left 2 !.param G=1
TEXT -88 -40 Left 4 ;GAIN
TEXT 144 -32 Left 2 ;2024-12-29

The netlist it stands for:
* 1Ph-CHB-PFC_3Cell.asc
Lgrid1 grid N003 2m Rser=1m
Clink1 link1 gnd1 2500µ IC={Vref} Rser=10m
Rload1 link1 gnd1 200
X§X1 SW1H ILgrid N003 IMON rsns=10u  ; pins n out p
X§X2 gnd1 Vlink1 link1 vmon
X§X3 0 grid vac1ph params: Vac=3.3k freq=60
X§X5 pwm1a N004 N001 deadtime params: dt=10n
X§X6 N020 CONST K={Vref}  ; pins K
X§X7 0 Vgrid grid vmon
X§X8 N001 G11 SW1H iGD  ; pins in g s
X§X9 N004 G12 gnd1 iGD  ; pins in g s
X§X11 VlinkAve N020 N017 type2 params: avol=100k g=0.5 fz1=20 fp1=100 vh=30 vl=0
X§XQ11 link1 G11 SW1H iNMOS params: esl=1f rsnb=1k csnb=10p ron=10m  ; pins D G S
X§XQ12 SW1H G12 gnd1 iNMOS params: esl=1f rsnb=1k csnb=10p ron=10m  ; pins D G S
X§XQ13 link1 G13 SW2H iNMOS params: esl=1f rsnb=1k csnb=10p ron=10m  ; pins D G S
X§XQ14 SW2H G14 gnd1 iNMOS params: esl=1f rsnb=1k csnb=10p ron=10m  ; pins D G S
Clink2 link2 gnd2 2500µ IC={Vref} Rser=10m
Rload2 link2 gnd2 200
X§X10 gnd2 Vlink2 link2 vmon
X§XQ21 link2 G21 SW2H iNMOS params: esl=1f rsnb=1k csnb=10p ron=10m  ; pins D G S
X§XQ22 SW2H G22 gnd2 iNMOS params: esl=1f rsnb=1k csnb=10p ron=10m  ; pins D G S
X§XQ23 link2 G23 SW3H iNMOS params: esl=1f rsnb=1k csnb=10p ron=10m  ; pins D G S
X§XQ24 SW3H G24 gnd2 iNMOS params: esl=1f rsnb=1k csnb=10p ron=10m  ; pins D G S
Clink3 link3 gnd3 2500µ IC={Vref} Rser=10m
Rload3 link3 gnd3 200
X§X19 gnd3 Vlink3 link3 vmon
X§XQ31 link3 G31 SW3H iNMOS params: esl=1f rsnb=1k csnb=10p ron=10m  ; pins D G S
X§XQ32 SW3H G32 gnd3 iNMOS params: esl=1f rsnb=1k csnb=10p ron=10m  ; pins D G S
X§XQ33 link3 G33 SW3L iNMOS params: esl=1f rsnb=1k csnb=10p ron=10m  ; pins D G S
X§XQ34 SW3L G34 gnd3 iNMOS params: esl=1f rsnb=1k csnb=10p ron=10m  ; pins D G S
X§X20 Vlink3 Vlink3f lpf params: f=1k n=1 q=0.5
X§X21 Vlink3f N021 N029 mul
X§X22 N021 CONST K=(1/3)  ; pins K
X§X24 Vlink2 Vlink2f lpf params: f=1k n=1 q=0.5
X§X25 Vlink2f N021 N024 mul
X§X26 Vlink1 Vlink1f lpf params: f=1k n=1 q=0.5
X§X27 Vlink1f N021 N014 mul
X§X28 N014 N024 N015 sum
X§X29 N015 N029 VlinkAve sum
X§X4 pwm1b N005 N002 deadtime params: dt=10n
X§X13 N002 G13 SW2H iGD  ; pins in g s
X§X15 N005 G14 gnd1 iGD  ; pins in g s
X§X17 pwm2a N008 N006 deadtime params: dt=10n
X§X23 N006 G21 SW2H iGD  ; pins in g s
X§X30 N008 G22 gnd2 iGD  ; pins in g s
X§X31 pwm2b N009 N007 deadtime params: dt=10n
X§X32 N007 G23 SW3H iGD  ; pins in g s
X§X33 N009 G24 gnd2 iGD  ; pins in g s
X§X34 pwm3a N012 N010 deadtime params: dt=10n
X§X35 N010 G31 SW3H iGD  ; pins in g s
X§X36 N012 G32 gnd3 iGD  ; pins in g s
X§X37 pwm3b N013 N011 deadtime params: dt=10n
X§X38 N011 G33 SW3L iGD  ; pins in g s
X§X39 N013 G34 gnd3 iGD  ; pins in g s
Lgrid2 0 SW3L 2m Rser=1m
X§X14 N017 N025 iref mul
X§X16 Vgrid N030 N025 mul
X§X18 N030 CONST K=(1/3.3k/1.4142)  ; pins K
X§X40 ILgrid iref N016 type2 params: avol=100k g=25 fz1=100 fp1=3k vh=500 vl=-500
X§X12 Vgrid N016 Vchb_ref sub
X§X41 d1 pwm1a pwm params: tri=1 freq=10k phase=0
X§X42 d2 pwm2a pwm params: tri=1 freq=10k phase=120
X§X43 d3 pwm3a pwm params: tri=1 freq=10k phase=240
X§X44 Vlink1f N023 inverse
X§X45 N026 N023 N027 mul
X§X46 Vlink2f N032 inverse
X§X47 N026 N032 N033 mul
X§X48 Vlink3f N036 inverse
X§X49 N026 N036 N037 mul
X§X50 Vchb_ref N022 N026 mul
X§X51 N022 CONST K=(1/3)  ; pins K
X§X52 N028 N018 d1 sum
X§X53 N034 N018 d2 sum
X§X54 N038 N018 d3 sum
X§X55 N018 CONST K=0.5  ; pins K
X§X56 N027 N028 gain params: G=0.5
X§X57 N033 N034 gain params: G=0.5
X§X58 N037 N038 gain params: G=0.5
X§X59 N019 d1 N031 sub
X§X60 N019 CONST K=1  ; pins K
X§X61 N031 pwm1b pwm params: tri=1 freq=10k phase=0
X§X62 N035 pwm2b pwm params: tri=1 freq=10k phase=120
X§X63 N019 d2 N035 sub
X§X64 N039 pwm3b pwm params: tri=1 freq=10k phase=240
X§X65 N019 d3 N039 sub

* block symbol definitions
.subckt vmon n out p
B1 out 0 V=V(p)-V(n)
I1 p n 0
* Voltage Monitor
* positive
* negative
* 2024-12-29
.ends vmon

.subckt vac1ph n p
V1 p n SINE(0 {vamp} {freq})
.param freq=60
.param vac=100
* Single Phase AC Power
* frequency(Hz)
* ac voltage(Vrms)
.param vamp={vac*SQRT(2)}
* 2026-06-21
* <Revision History>
* 2024-12-29: Initial version
* 2026-06-21: Corrected amplitude calculation by removing the 0.5 factor.
.ends vac1ph

.subckt deadtime in l h
A1 in 0 0 0 0 0 N002 0 BUF
A2 in 0 0 0 0 0 N001 0 BUF TD={dt}
A3 0 N001 0 N002 0 0 h 0 AND
A4 0 N001 0 N002 0 l 0 0 OR
.param dt=10n
* Deadtime Generator
* deadtime(sec)
* hi-side
* lo-side
* in
* h
* l
* dt
* dt
* 2024-12-29
.ends deadtime

.subckt type2 fb ref ve
R1 N002 N001 {R1}
C1 ve N002 {C1}
C2 ve N001 {C2}
B1 N003 0 V=V(fb)
R2 N001 N003 {R2}
XU1 ref N001 +V -V ve level2 Avol={avol} GBW=10Meg Slew=10Meg Ilimit=25m Rail=0 Vos=0 En=0 Enk=0 In=0 Ink=0 Rin=500Meg  ; pins In+ In- V+ V- OUT
V2 +V 0 {vh}
V3 -V 0 {vl}
.lib opamp.sub
.param g=1
.param fz1=1k
.param fp1=20k
.param vh=5
.param vl=0
.param avol=100k
.param R1=({R2}*{g})
.param C1=1/(2*PI*{R1}*{fz1})
.param C2=1/(2*PI*{R1}*{fp1})
* Type 2 Compensator
.param R2=100k
* target gain at fz1
* zero frequency(Hz)
* pole frequency(Hz)
* max ouput voltage(V)
* min output voltage(V)
* open loop gain
* feedback
* reference
.ic V(ve)=0
* 2024-12-29
.ends type2

.subckt lpf in out
R1 a N001 1k
C1 a 0 {Co}
B1 N001 0 V=V(in)
B2 v0 0 V=V(a)
B3 out 0 V=IF({n}==1,V(v0),V(v1))
R2 v1 0 1Gig
C2 v1 0 1
B5 0 v1 I=V(v2)
R3 v2 0 1Gig
C3 v2 0 1
B4 0 v2 I={-(2*pi*f)*(2*pi*f)*V(v1)-(2*pi*f/q)*V(v2)+(2*pi*f)*(2*pi*f)*V(in)}
* 1st/2nd order Low Pass Filter
* 2025-12-26
.param f=100k
.param n=1
.param q=0.5
.param Co=1/({f}*2k*PI)
* cut off frequency
* filter order (1:1st order, other: 2nd order)
* q factor (only for 2nd order)
* 1st Order LPF
* 2nd Order LPF
* <Revision History>
* 2025-03-23: Initial version
* 2025-12-26:
*  -  Replaced LTspice built in 2ndOrderLPF with discrete circuit to improve convergence.
*  -  Removed output MUX and replaced it with BV.
.ends lpf

.subckt mul in1 in2 out
B1 OUT 0 V=V(IN1)*V(IN2)
R1 IN1 0 1Meg
R2 IN2 0 1Meg
* Multiplier
.ends mul

.subckt sum in1 in2 out
B1 OUT 0 V=V(IN1)+V(IN2)
* SUM
* 2024-12-29
.ends sum

.subckt sub in1 in2 out
B1 OUT 0 V=V(IN1)-V(IN2)
* SUBTRACT
* 2024-12-29
.ends sub

.subckt pwm duty pwm
R2 c 0 1k
A1 c 0 0 0 0 0 pwm 0 BUF
V1 saw 0 PULSE(0 1 {phase/(360*freq)} {IF(tri==0,1/freq-1n,1/(2*freq))} {IF(tri==0,0.5n,1/(2*freq))} {IF(tri==0,0.5n,0)} {1/freq})
.machine
.state LO 0
.state HI 1
.rule HI LO V(saw)>V(duty)
.rule LO HI V(saw)< V(duty)
.output (c) state
.endmachine
.param freq=100k
.ic V(pwm)=0
.param phase=0
* Pulse Width Modulator
* 2026-09-21
* frequency(Hz)
.param tri=0
* 0: Saw, 1; Triangular
* phase(deg)
* <Revision History>
* 2024-12-29: Initial version
* 2026-09-21: Added tri parameter to select a triangular carrier (tri=1) or retain the original sawtooth carrier (tri=0, default).
.ends pwm

.subckt inverse in out
B1 out 0 V=IF(V(in)>0,IF(V(in)>(1/{vsat}),1/V(in),{vsat}),IF(V(in)>(-1/{vsat}),-{vsat},1/V(in)))
C1 out 0 10p Rser=1k
* Inverse
* 2025-2-23
.param vsat=1k
* saturation voltage
* <Revision History>
* 2025-01-03: Initial Versoin.
* 2025-02-23: Added RC snubber(10pF-1kohm) at output to reduce spike
.ends inverse

.subckt gain in out
B1 out 0 V={G}*V(in)
.param G=1
* GAIN
* 2024-12-29
.ends gain

* Single Phase Cascaded H-Bridge PFC
.tran 0 150m 10m
* 2026-09-21
* 2026-09-21       Initial release
.options solver="norm"
.options method="gear"
.param Vref=1800
.ic I(Lgrid1)=0 I(Lgrid2)=0
* Cell1
* Cell2
* Cell3
.lib UniversalOpAmp2.lib
.backanno
.end